# Altium schematic sheet cpuadcinput.SchDoc
size A4
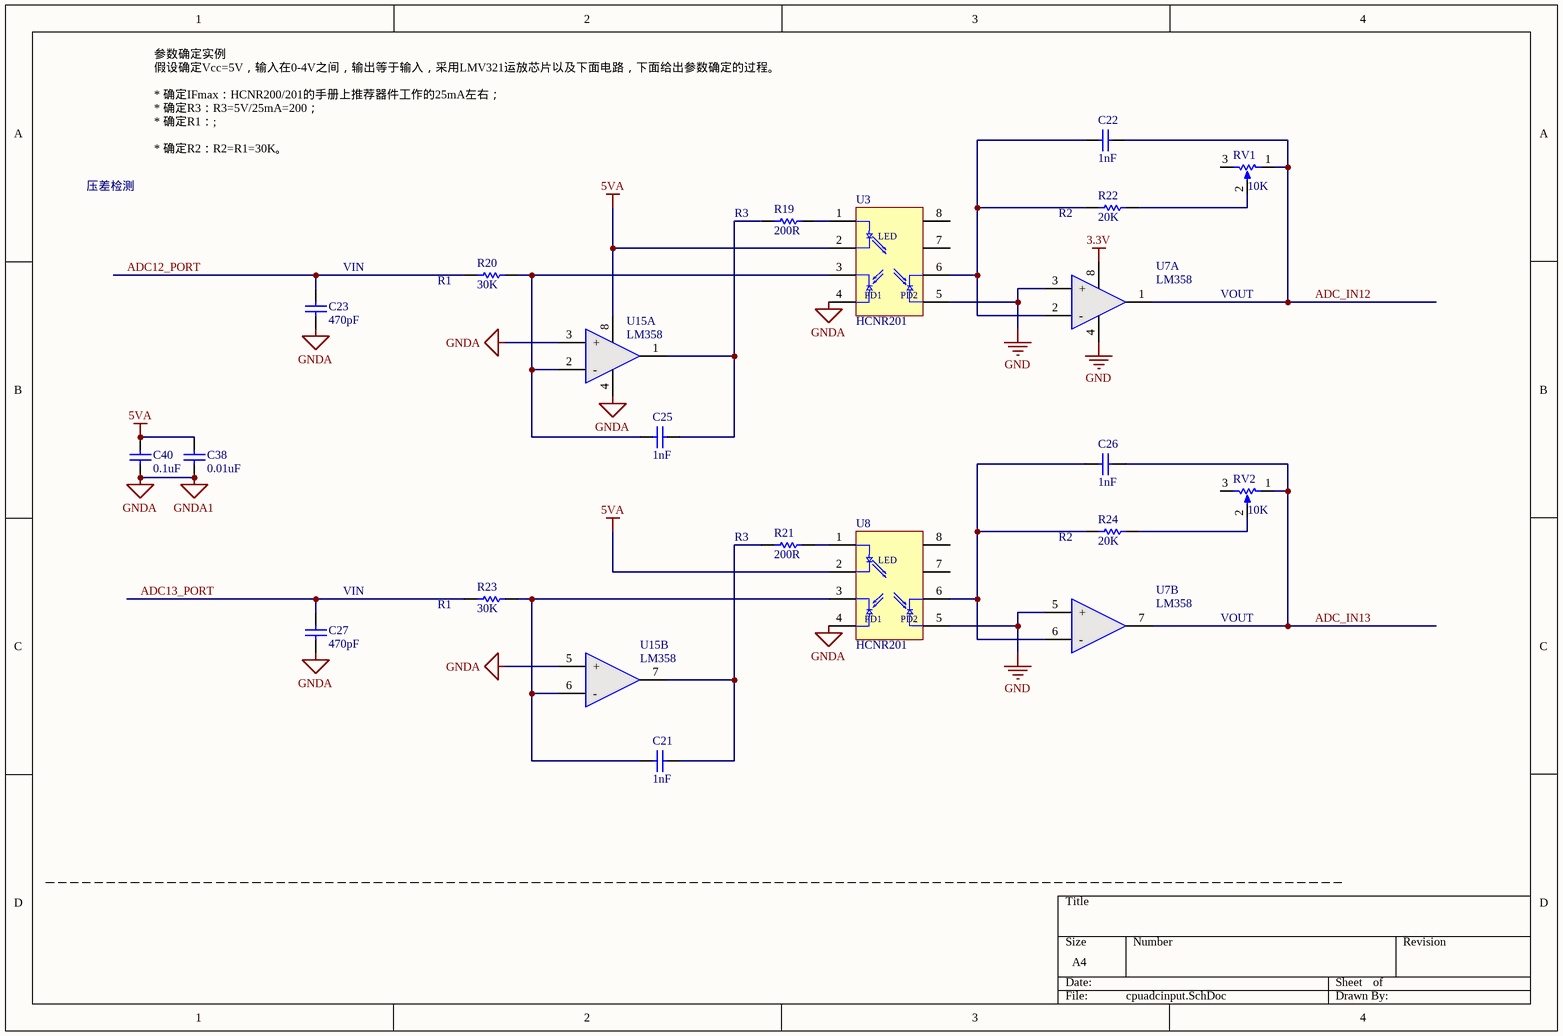
[diagram p0: cpuadcinput.SchDoc]

## Parts
C21  1nF  [CAPC2012M]
C22  1nF  [CAPC2012M]
C23  470pF  [CAPC2012M]
C25  1nF  [CAPC2012M]
C26  1nF  [CAPC2012M]
C27  470pF  [CAPC2012M]
C38  0.01uF  [CAPC2012M]
C40  0.1uF  [CAPC2012M]
R19  200R  [RESC2012M]
R20  30K  [RESC2012M]
R21  200R  [RESC2012M]
R22  20K  [RESC2012M]
R23  30K  [RESC2012M]
R24  20K  [RESC2012M]
RV1  10K  [3224W]
RV2  10K  [3224W]
U3  HCNR201  [SO8WL]
U7  LM358  [NSO8_N]  (parts A,B of 2)
U8  HCNR201  [SO8WL]
U15  LM358  [NSO8_N]  (parts A,B of 2)

## Nets
3.3V: U7.8(V+)
5VA: C38.2 C40.2 U3.2(ANODE) U8.2(ANODE) U15.8(V+)
GND: U3.5(GND) U7.3(+) U7.4(V-) U7.5(+) U8.5(GND)
GNDA: C23.1 C27.1 C38.1 C40.1 U3.4(NC) U8.4(NC) U15.3(+) U15.4(V-) U15.5(+)  [also labelled GNDA1]
ADC12_PORT: C23.2 R20.2
ADC13_PORT: C27.2 R23.2
ADC_IN12: C22.2 RV1.1(TOP) U7.1(OUT1)
ADC_IN13: C26.2 RV2.1(TOP) U7.7(OUT2)
NetC21_1: C21.1 R23.1 U8.3(CATHODE) U15.6(-)
NetC21_2: C21.2 R21.1 U15.7(OUT2)
NetC22_1: C22.1 R22.2 U3.6(Vo) U7.2(-)
NetC25_1: C25.1 R20.1 U3.3(CATHODE) U15.2(-)
NetC25_2: C25.2 R19.1 U15.1(OUT1)
NetC26_1: C26.1 R24.2 U7.6(-) U8.6(Vo)
NetR19_2: R19.2 U3.1(NC)
NetR21_2: R21.2 U8.1(NC)
NetR22_1: R22.1 RV1.2(TAP)
NetR24_1: R24.1 RV2.2(TAP)

Not connected (* = marked no-connect by the designer): RV1 3(BOT); RV2 3(BOT); U3 7(VL) 8(VCC); U8 7(VL) 8(VCC)

## Notes on the sheet
- 参数确定实例 
  假设确定Vcc=5V，输入在0-4V之间，输出等于输入，采用LMV321运放芯片以及下面电路，下面给出参数确定的过程。
  * 确定IFmax：HCNR200/201的手册上推荐器件工作的25mA左右； 
  * 确定R3：R3=5V/25mA=200；
  * 确定R1：; 
  * 确定R2：R2=R1=30K。 
  VOUT/VIN = R2/R1.
- 压差检测
- (near R19) R3
- (near R22) R2
- (near C23) VIN
- (near R20) R1
- VOUT
- (near R21) R3
- (near R24) R2
- (near C27) VIN
- (near R23) R1
- (in symbol HCNR200/201) LED; PD1; PD2

## Library data of the parts
C21 C22 C25 C26 = Cap: Capacitor; Published: 8-Jun-2000; LatestRevisionDate: 17-Jul-2002; LatestRevisionNote: Re-released for DXP Platform.; PackageReference: RAD-0.3; Publisher: Altium Limited; Value: 1nF
C23 C27 C38 C40 = Cap: Capacitor; Value: 1nF; Published: 8-Jun-2000; LatestRevisionDate: 17-Jul-2002; LatestRevisionNote: Re-released for DXP Platform.; PackageReference: RAD-0.3; Publisher: Altium Limited
R19-R24 = Res1: Resistor; Value: 10K; Published: 8-Jun-2000; LatestRevisionDate: 17-Jul-2002; LatestRevisionNote: Re-released for DXP Platform.; PackageReference: AXIAL-0.3; Publisher: Altium Limited
RV1 RV2 = RPot-A: Potentiometer; Sim Note: Enter the Resistance value and the set point into parameter fields.; Set Position: 0.5; Value: 1K; Published: 8-Jun-2000; LatestRevisionDate: 17-Jul-2002; LatestRevisionNote: Re-released for DXP Platform.; PackageReference: VR5; Publisher: Altium Limited
U3 U8 = HCNR200/201: High-Linearity Analog  Optocouplers
U7 U15 = LM358: 双运放